# Altium schematic sheet Analogue_frontend.SchDoc
size A
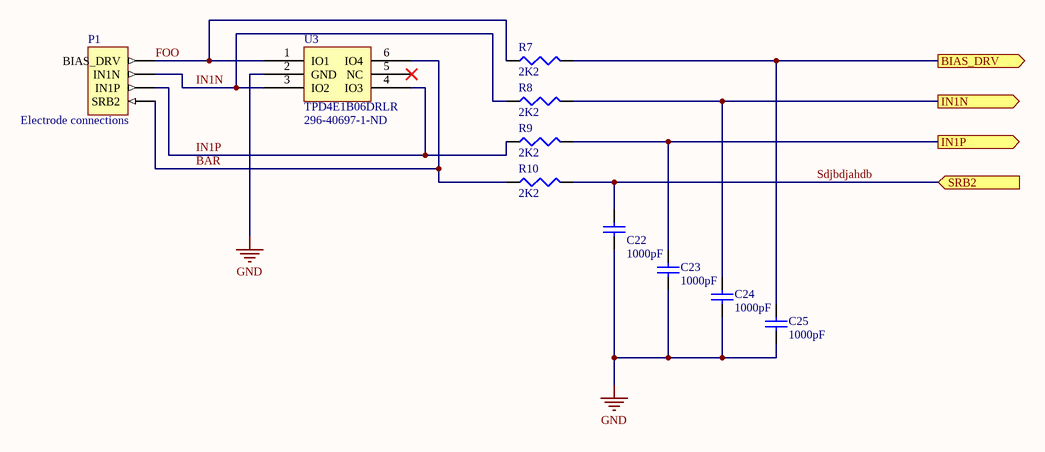
[diagram p0: Analogue_frontend.SchDoc]

## Parts
C22  value 1000pF  [1608[0603]]  (hidden comment: Cap Semi)
C23  value 1000pF  [1608[0603]]  (hidden comment: Cap Semi)
C24  value 1000pF  [1608[0603]]  (hidden comment: Cap Semi)
C25  value 1000pF  [1608[0603]]  (hidden comment: Cap Semi)
P1  Electrode connections  [HDR1X4]
R7  value 2K2  [J1-0603]  (hidden comment: Res3)
R8  value 2K2  [J1-0603]  (hidden comment: Res3)
R9  value 2K2  [J1-0603]  (hidden comment: Res3)
R10  value 2K2  [J1-0603]  (hidden comment: Res3)
U3  TPD4E1B06DRLR  Supplier Part Number 1: 296-40697-1-ND  [SOT50P185X60-6N]

## Ports
BIAS_DRV (out), IN1N (out), IN1P (out), SRB2 (in)

## Nets
GND: C22.1 C23.1 C24.1 C25.1 U3.2(GND)
BAR: P1.1(SRB2) R10.1 U3.6(IO4)
BIAS_DRV: C25.2 R7.2 ; port BIAS_DRV
FOO: P1.4(BIAS_DRV) R7.1 U3.1(IO1)
IN1N: P1.3(IN1N) R8.1 U3.3(IO2)
IN1N: C24.2 R8.2 ; port IN1N  [a separate net that carries the same name]
IN1P: P1.2(IN1P) R9.1 U3.4(IO3)
IN1P: C23.2 R9.2 ; port IN1P  [a separate net that carries the same name]
Sdjbdjahdb: C22.2 R10.2 ; port SRB2

Not connected (* = marked no-connect by the designer): U3 5(NC)*

## Library data of the parts
C22-C25 = Cap Semi: Capacitor (Semiconductor SIM Model); Published: 8-Jun-2000; LatestRevisionDate: 29-May-2009; LatestRevisionNote: IPC-7351 Footprint Added.; PackageReference: C1206; Publisher: Altium Limited; PackageDescription: Chip Capacitor
P1 = Header 4: Header, 4-Pin; LatestRevisionDate: 17-Jul-2002; LatestRevisionNote: Re-released for DXP Platform.; Publisher: Altium Limited
R7-R10 = Res3: Resistor; Published: 8-Jun-2000; LatestRevisionDate: 29-May-2009; LatestRevisionNote: IPC-7351 Footprint Added.; PackageReference: J1-0603; Publisher: Altium Limited; PackageDescription: Chip Resistor
U3 = TPD4E1B06DRLR: TVS DIODE 5.5VWM 14.5VC 6SOT; Manufacturer: Texas Instruments; Bidirectional Channels: 4; Voltage - Reverse Standoff (Typ): 5.5V (Max); Voltage - Breakdown (Min): 7V; Voltage - Clamping (Max) @ Ipp: 14.5V (Typ); Current - Peak Pulse (10/1000µs): 3A (8/20µs); Power - Peak Pulse: 45W; Power Line Protection: No; Supplier 1: Digi-Key; Manufacturer Part Number: TPD4E1B06DRLR; RoHS: RoHS Compliant By Exemption; Category: Circuit Protection; Stock 1: 2244; Pricing 1: 1=0.67, 10=0.585, 25=0.5168, 100=0.4504, 250=0.39204, 500=0.33372, 750=0.2916, 1000=0.2673 (USD); Packaging: Cut Tape (CT); Type: Steering (Rail to Rail); Unidirectional Channels: -; Applications: General Purpose; Capacitance @ Frequency: -; Operating Temperature: -40°C ~ 125°C (TA); Mounting Type: Surface Mount; Package / Case: SOT-563, SOT-666; Supplier Device Package: SOT-6; ComponentLink1URL: http://www.ti.com/lit/ds/symlink/tpd4e1b06.pdf; ComponentLink1Description: http://www.ti.com/lit/ds/symlink/tpd4e1b06.pdf